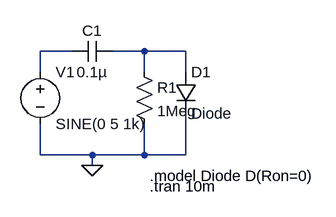
[diagram p0: schematic Pranala Luar - Clamper Circuit Simulation in LTspice.asc]
Pranala Luar - Clamper Circuit Simulation in LTspice.asc, the LTspice schematic file:
Version 4
SHEET 1 880 680
WIRE -80 96 -128 96
WIRE 32 96 -16 96
WIRE 96 96 32 96
WIRE -128 128 -128 96
WIRE 32 128 32 96
WIRE 96 128 96 96
WIRE -128 256 -128 208
WIRE -48 256 -128 256
WIRE 32 256 32 208
WIRE 32 256 -48 256
WIRE 96 256 96 192
WIRE 96 256 32 256
WIRE -48 272 -48 256
FLAG -48 272 0
SYMBOL diode 80 128 R0
SYMATTR InstName D1
SYMATTR Value Diode
SYMBOL res 16 112 R0
SYMATTR InstName R1
SYMATTR Value 1Meg
SYMBOL cap -16 80 R90
WINDOW 0 0 32 VBottom 2
WINDOW 3 32 32 VTop 2
SYMATTR InstName C1
SYMATTR Value 0.1µ
SYMBOL voltage -128 112 R0
WINDOW 123 0 0 Left 0
WINDOW 39 0 0 Left 0
SYMATTR InstName V1
SYMATTR Value SINE(0 5 1k)
TEXT 40 288 Left 2 !.model Diode D(Ron=0)
TEXT 40 304 Left 2 !.tran 10m

The netlist it stands for:
* Pranala Luar - Clamper Circuit Simulation in LTspice.asc
D1 N002 0 Diode
R1 N002 0 1Meg
C1 N002 N001 0.1µ
V1 N001 0 SINE(0 5 1k)
.model D D
.lib standard.dio
.model Diode D(Ron=0)
.tran 10m
.backanno
.end